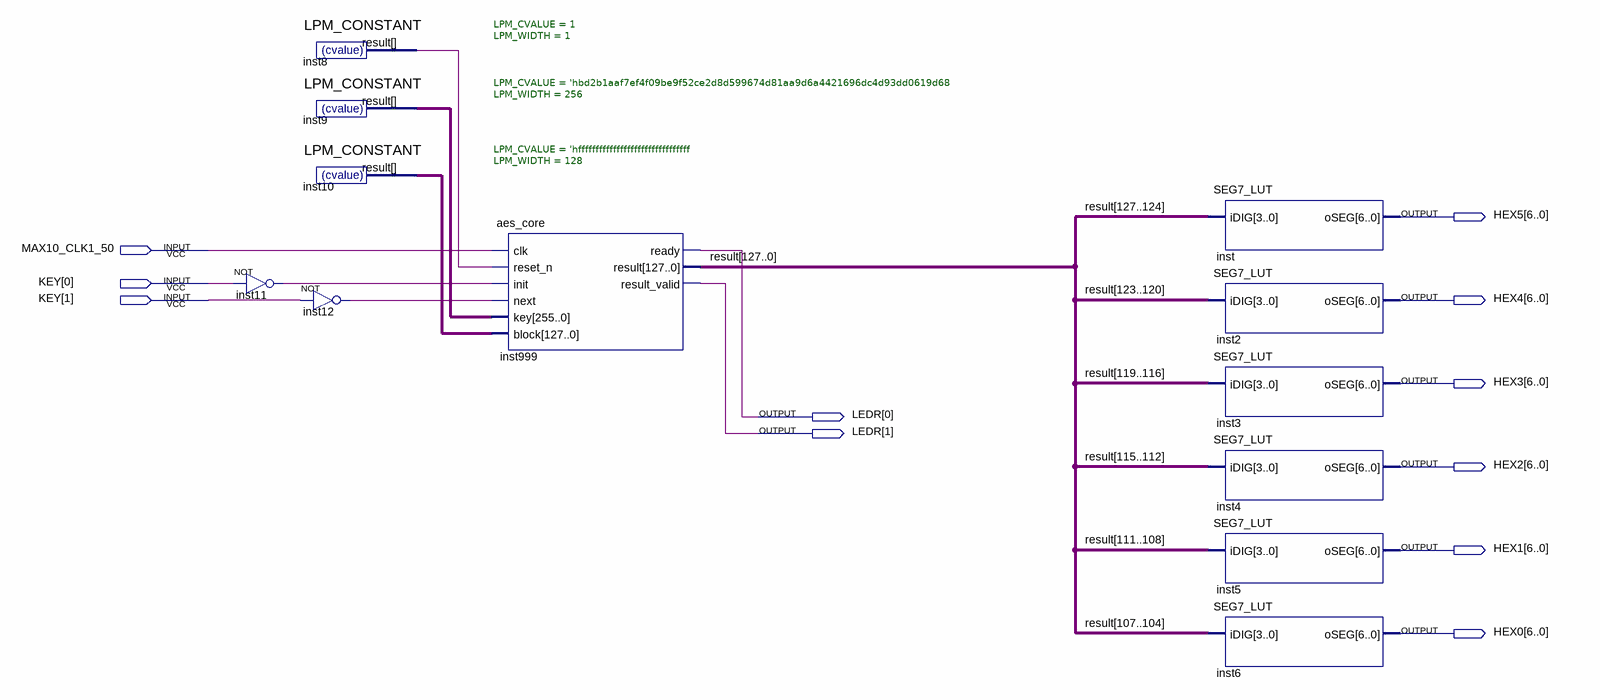
[diagram p0: schematic sheet]
// Quartus schematic top.bdf as structural Verilog: 12 symbols, 11 pins
module top (
  input  MAX10_CLK1_50,
  input  [1:0] KEY,
  output [6:0] HEX5,
  output [6:0] HEX4,
  output [6:0] HEX3,
  output [1:0] LEDR,
  output [6:0] HEX2,
  output [6:0] HEX1,
  output [6:0] HEX0
);

  wire inst8_result, inst11_out, inst12_out;
  wire [127:0] inst10_result, result;
  wire [255:0] inst9_result;

  not inst11 (inst11_out, KEY[0]);
  LPM_CONSTANT #(.LPM_CVALUE(1), .LPM_WIDTH(1)) inst8 (.result(inst8_result));
  LPM_CONSTANT #(.LPM_CVALUE('hbd2b1aaf7ef4f09be9f52ce2d8d599674d81aa9d6a4421696dc4d93dd0619d68), .LPM_WIDTH(256)) inst9 (.result(inst9_result));
  LPM_CONSTANT #(.LPM_CVALUE('hffffffffffffffffffffffffffffffff), .LPM_WIDTH(128)) inst10 (.result(inst10_result));
  not inst12 (inst12_out, KEY[1]);
  aes_core inst999 (
    .clk(MAX10_CLK1_50), .reset_n(inst8_result), .init(inst11_out), .next(inst12_out), .key(inst9_result),
    .block(inst10_result), .ready(LEDR[0]), .result(result), .result_valid(LEDR[1]));
  SEG7_LUT inst (.iDIG(result[127:124]), .oSEG(HEX5));
  SEG7_LUT inst2 (.iDIG(result[123:120]), .oSEG(HEX4));
  SEG7_LUT inst3 (.iDIG(result[119:116]), .oSEG(HEX3));
  SEG7_LUT inst4 (.iDIG(result[115:112]), .oSEG(HEX2));
  SEG7_LUT inst5 (.iDIG(result[111:108]), .oSEG(HEX1));
  SEG7_LUT inst6 (.iDIG(result[107:104]), .oSEG(HEX0));
endmodule
